# Altium schematic sheet 5v and Filters.SchDoc
size A4; SheetNumber: 1; SheetTotal: 3
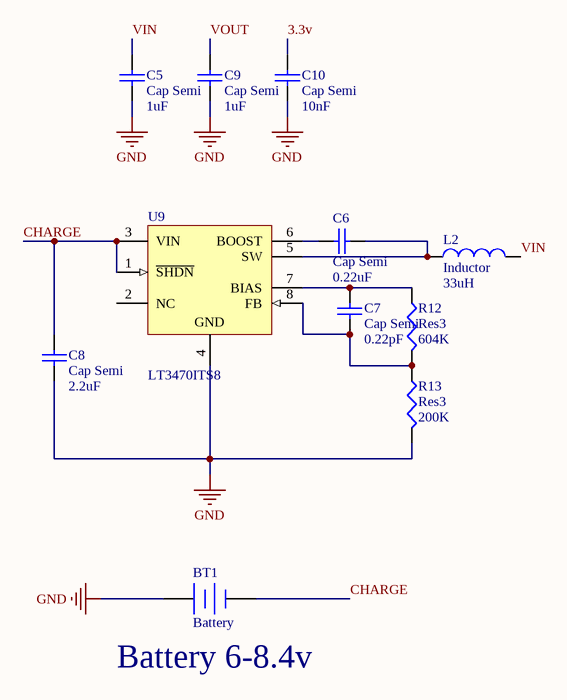
[diagram p0: 5v and Filters.SchDoc]

## Parts
BT1  Battery  [BAT-2]
C5  Cap Semi  value 1uF  [C1206]
C6  Cap Semi  value 0.22uF  [C1206]
C7  Cap Semi  value 0.22pF  [C1206]
C8  Cap Semi  value 2.2uF  [C1206]
C9  Cap Semi  value 1uF  [C1206]
C10  Cap Semi  value 10nF  [C1206]
L2  Inductor  value 33uH  [0402-A]
R12  Res3  value 604K  [J1-0603]
R13  Res3  value 200K  [J1-0603]
U9  LT3470ITS8  [LT-TS8-8-TSOT-23_V]

## Nets
GND: BT1.1(+) C5.1 C8.2 C9.1 C10.1 R13.2 U9.4(GND)
3.3v: C10.2
CHARGE: BT1.2(-) C8.1 U9.1(~{SHDN}) U9.3(VIN)
VIN: C5.2 L2.2
VOUT: C9.2
NetC6_1: C6.1 U9.6(BOOST)
NetC6_2: C6.2 L2.1 U9.5(SW)
NetC7_1: C7.1 R12.1 U9.7(BIAS)
NetC7_2: C7.2 R12.2 R13.1 U9.8(FB)

Not connected (* = marked no-connect by the designer): U9 2(NC)

## Notes on the sheet
- (near BT1) Battery 6-8.4v

## Library data of the parts
BT1 = Battery: Multicell Battery; Published: 24-Mar-1999; LatestRevisionDate: 17-Jul-2002; LatestRevisionNote: Re-released for DXP Platform.; PackageReference: BAT-2; Publisher: Altium Limited; PackageDescription: Battery; 2 Leads
C5-C10 = Cap Semi: Capacitor (Semiconductor SIM Model); Published: 8-Jun-2000; LatestRevisionDate: 29-May-2009; LatestRevisionNote: IPC-7351 Footprint Added.; PackageReference: C1206; Publisher: Altium Limited; PackageDescription: Chip Capacitor
L2 = Inductor: Code_IEC: 1005; Published: 8-Jun-2000; LatestRevisionDate: 29-May-2009; LatestRevisionNote: IPC-7351 Footprint Added.; PackageReference: 0402-A; Publisher: Altium Limited; PackageDescription: Chip Inductor; Code_JEITA: 0402
R12 R13 = Res3: Resistor; Published: 8-Jun-2000; LatestRevisionDate: 29-May-2009; LatestRevisionNote: IPC-7351 Footprint Added.; PackageReference: J1-0603; Publisher: Altium Limited; PackageDescription: Chip Resistor
U9 = CMP-0491-02134-1: Micropower Buck Regulator with Integrated Boost and Catch Diode, 8-pin SOT23 (TS8-8), -40 to 125 degC; Manufacturer: Linear Technology; Number of Outputs: 1; PackageVersion: Rev. A, 08/2010; ComponentLink1Description: Manufacturer URL; PartNumber: LT3470ITS8; DatasheetVersion: Rev. D; ComponentLink3Description: Package Specification; ComponentLink3URL: http://cds.linear.com/docs/en/packaging/SOT_8_05-08-1637.pdf; ComponentLink2URL: http://cds.linear.com/docs/en/datasheet/3470fd.pdf; PackageDescription: 8-Pin Plastic TSOT-23, Body 2.9 x 1.63 mm, Pitch 0.65 mm; PackageReference: TS8-8; ComponentLink2Description: Datasheet; ComponentLink1URL: http://www.linear.com/; Code_JEDEC: MO-193; Mounting Technology: Surface Mount; RoHS: FALSE